# EAGLE design ESP32 and power (EAGLE 9.4.0)
COMPANY: ADAFRUIT INDUSTRIES; DRAWN: KTOWN; REV: B
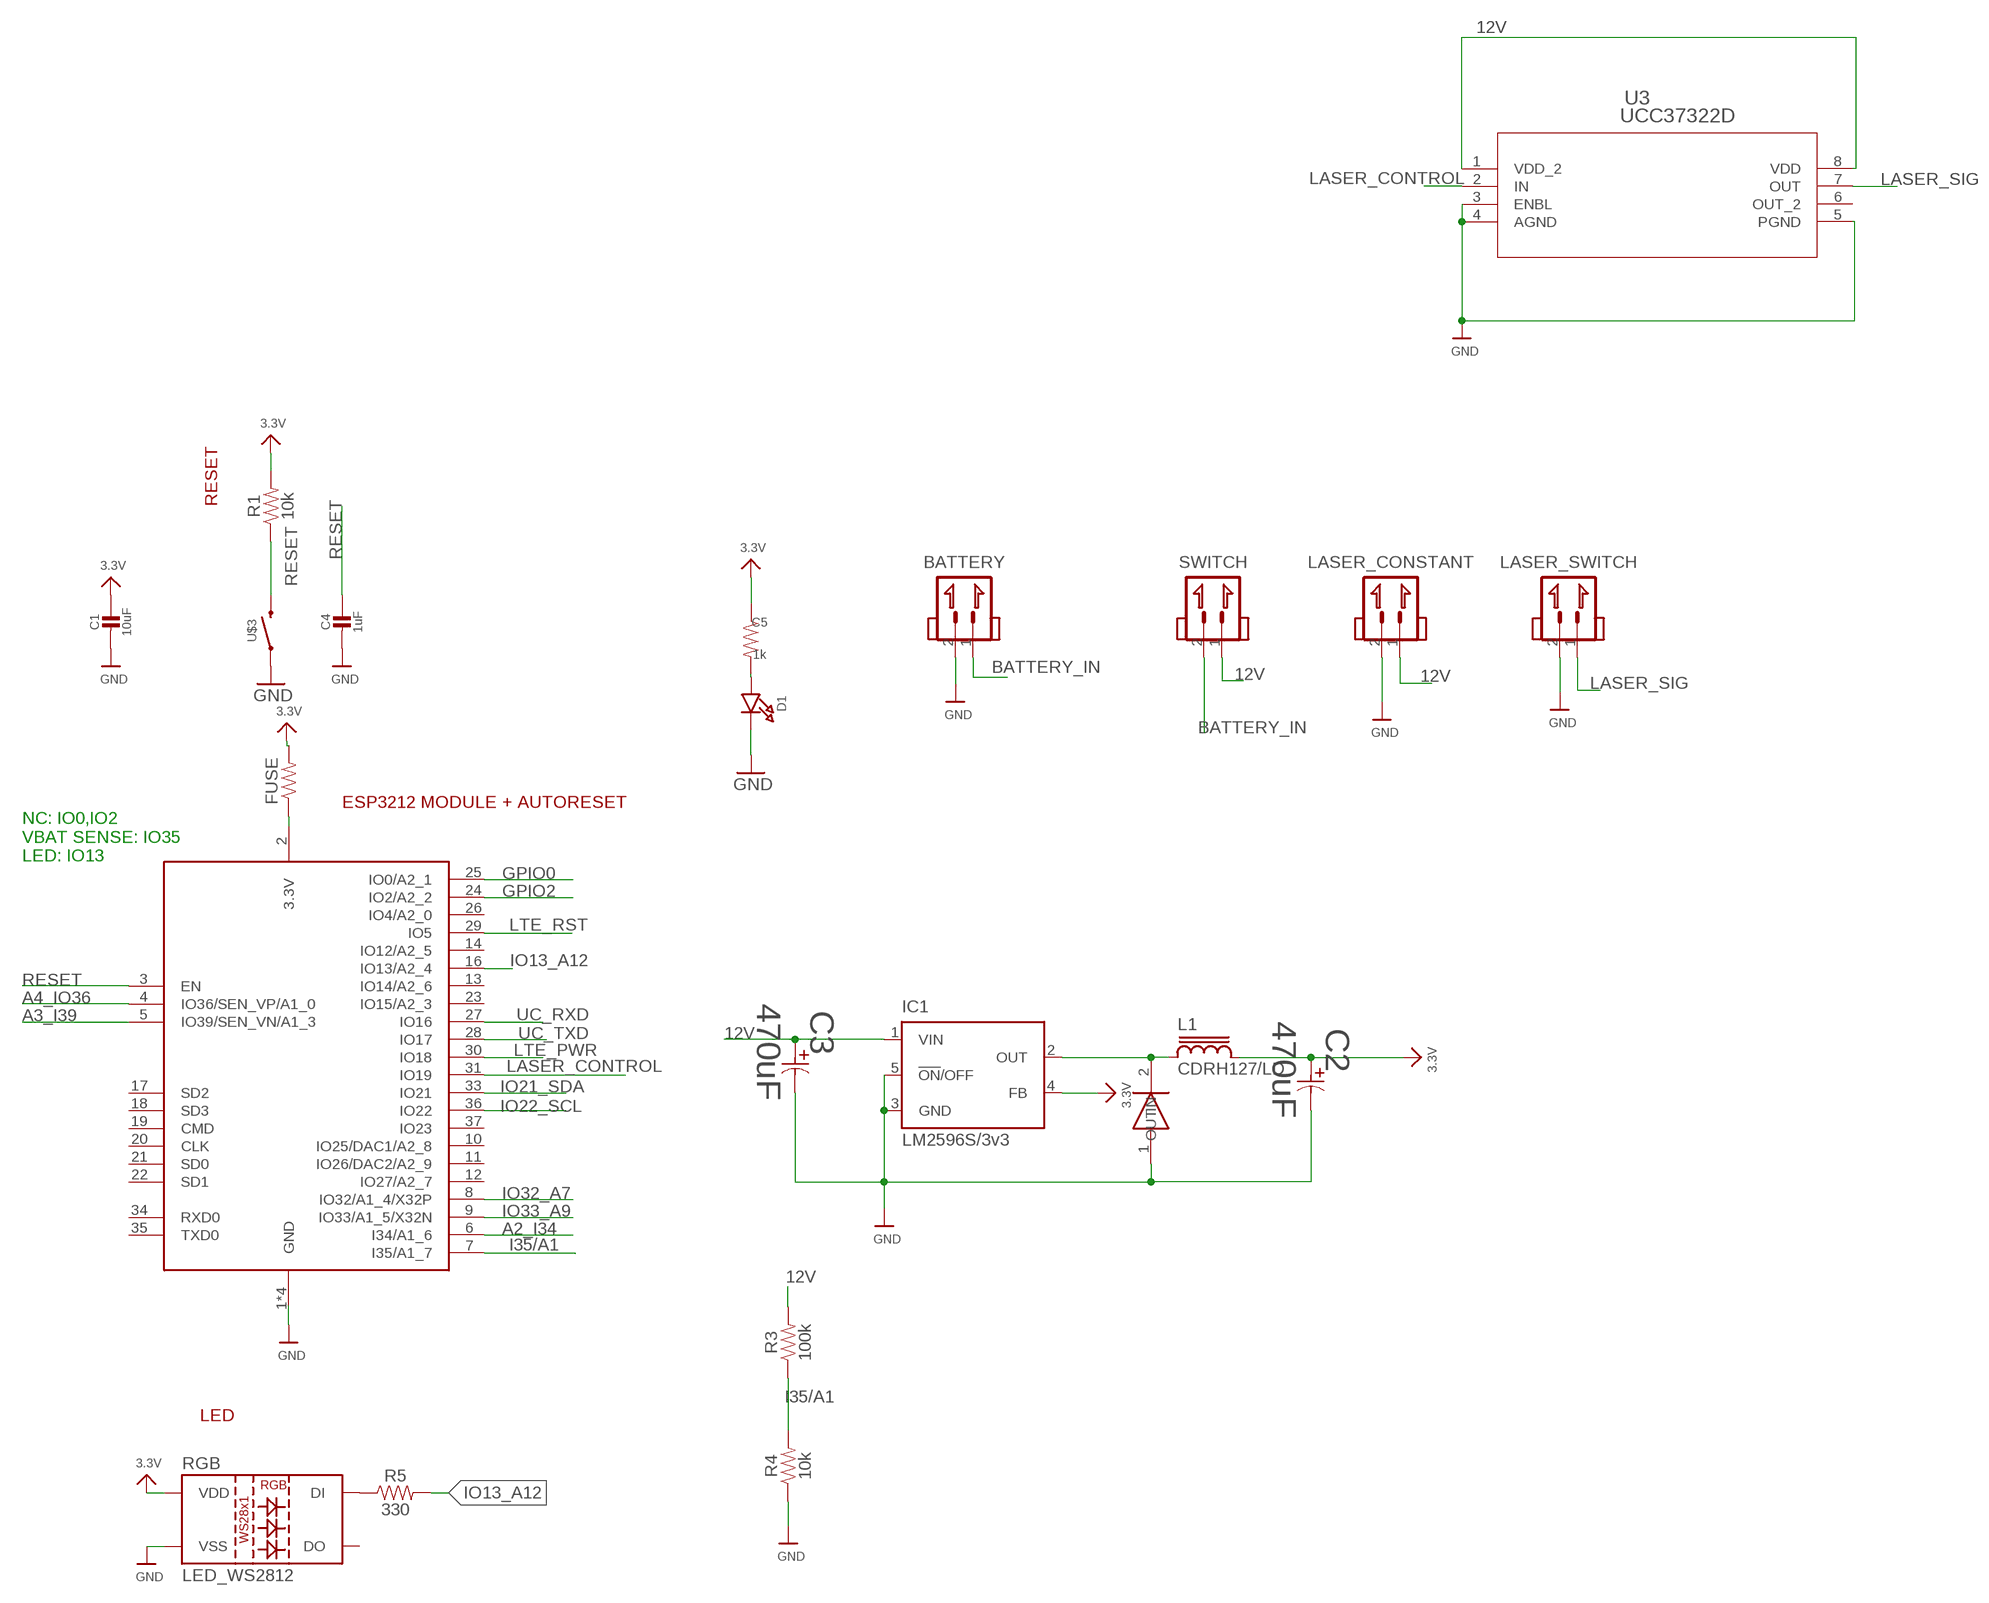
[diagram p0: schematic, sheet 1, part 1 of 2]
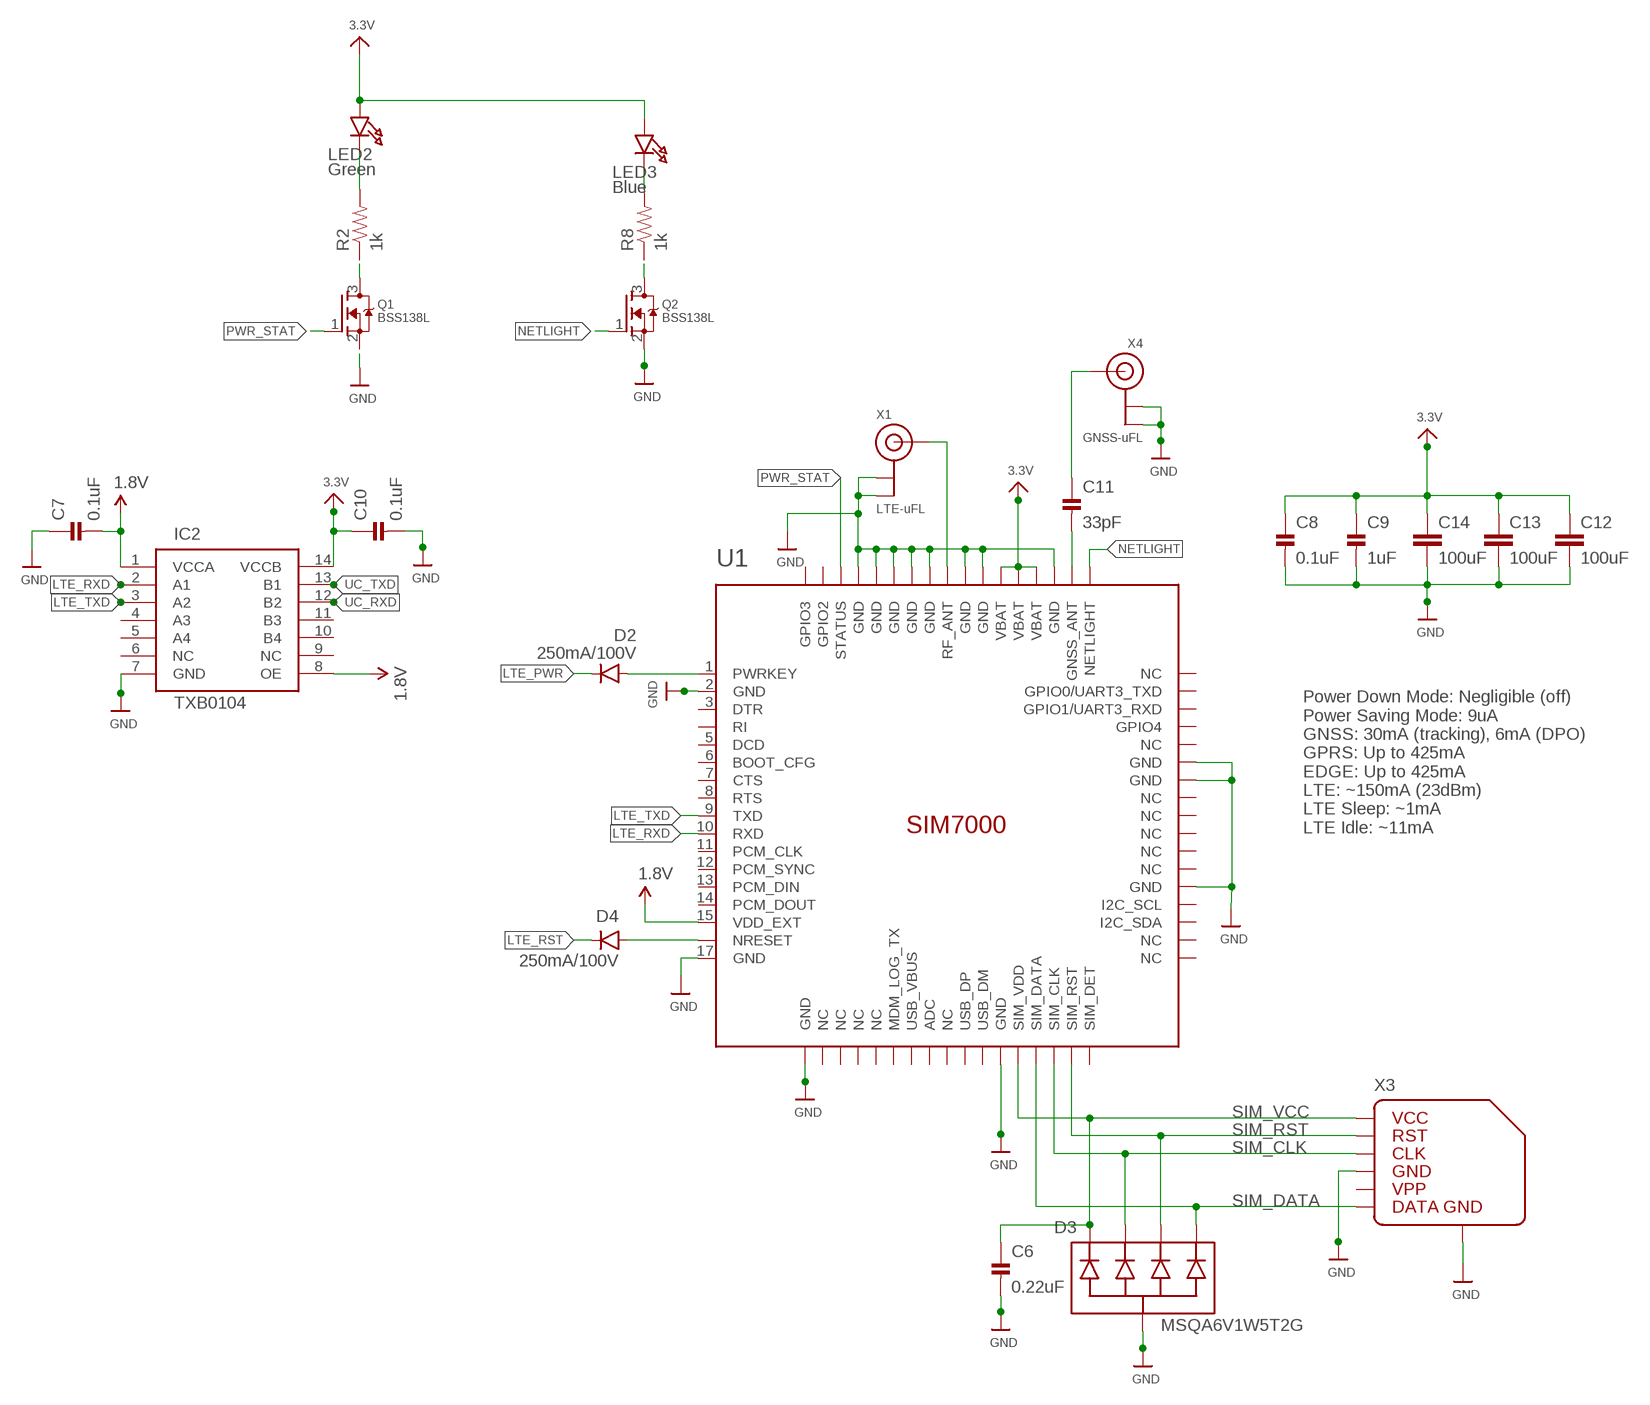
[diagram p1: schematic, sheet 1, part 2 of 2]

## Parts
BATTERY  JST_XH_2.54_2P  [JST_XH_2.54_2P]
C1  10uF  CAP_CERAMIC_0603  [CAP_0603]
C2  470uF  UCD1C471MNL1GS  [PCAP_8X10-ELECT]
C3  470uF  UCD1C471MNL1GS  [PCAP_8X10-ELECT]
C4  1uF  CAP_CERAMIC_0603  [CAP_0603]
C5  1k  RESISTOR0603  [0603]
C6  0.22uF  CAP_CERAMIC_0603  [CAP_0603]
C7  0.1uF  CAP_CERAMIC_0603  [CAP_0603]
C8  0.1uF  CAP_CERAMIC_0603  [CAP_0603]
C9  1uF  CAP_CERAMIC_0603  [CAP_0603]
C10  0.1uF  CAP_CERAMIC_0603  [CAP_0603]
C11  33pF  CAP_CERAMIC_0603  [CAP_0603]
C12  100uF  CAPMARKED-1210  [1210]
C13  100uF  CAPMARKED-1210  [1210]
C14  100uF  CAPMARKED-1210  [1210]
D1  LED0603  [MICROBUILDER_CHIPLED_0603]
D2  250mA/100V  DIODESOD323  [SOD-323]
D3  MSQA6V1W5T2G  TVS-DIODE-ARRAY-4X  [SOT-353]
D4  250mA/100V  DIODESOD323  [SOD-323]
FUSE  RESISTOR1206  [1206]
IC1  LM2596S/3v3  LM2596S  [TO263-5]
IC2  TXB0104  LEVEL_SHIFTER_TXB0104  [TSSOP-14]
L1  CDRH127/LD  [CDRH127/LD]
LASER_CONSTANT  JST_XH_2.54_2P  [JST_XH_2.54_2P]
LASER_SWITCH  JST_XH_2.54_2P  [JST_XH_2.54_2P]
LED2  Green  LED0603  [MICROBUILDER_CHIPLED_0603]
LED3  Blue  LED0603  [MICROBUILDER_CHIPLED_0603]
Q1  BSS138L  MOSFET-NGENERIC  [SOT23-3]
Q2  BSS138L  MOSFET-NGENERIC  [SOT23-3]
R1  10k  RESISTOR0603  [0603]
R2  1k  RESISTOR0603  [0603]
R3  100k  RESISTOR0603  [0603]
R4  10k  RESISTOR0603  [0603]
R5  330  RESISTOR0603  [0603]
R8  1k  RESISTOR0603  [0603]
RGB  LED_WS2812  [LED-TRICOLOR-5050-IC]
SS34  40V3A  SMA-SS34  [SMA-SS34]
SWITCH  JST_XH_2.54_2P  [JST_XH_2.54_2P]
U1  SIM7000  [SIM7000]
U3  UCC37322D  [D8]
U$3  PUSHBUTTON  [TACTILE_SWITCH_SMD_6.0X3.5MM]
X1  LTE-uFL  ANTENNA_U.FL  [U.FL]
X2  ESP32_WROOM32_SKINNY  [WROOM32_SKINNY]
X3  MICROSIM_SOCKET  [MICROSIM_SOCKET]
X4  GNSS-uFL  ANTENNA_U.FL  [U.FL]

## Nets
1.8V: C7.2 IC2.1(VCCA) IC2.8(OE) U1.15(VDD_EXT)
3.3V: C1.1 C2.1 C5.1 C8.1 C9.1 C10.1 C12.1 C13.1 C14.1 FUSE.2 IC1.4(FB) IC2.14(VCCB) L1.2 LED2.A LED3.A R1.2 RGB.VDD U1.55(VBAT) U1.56(VBAT) U1.57(VBAT)
12V: C3.1 IC1.1(VIN) LASER_CONSTANT.1 R3.2 SWITCH.1 U3.1(VDD_2) U3.8(VDD)
A2_I34: X2.6(I34/A1_6)
A3_I39: X2.5(IO39/SEN_VN/A1_3)
A4_IO36: X2.4(IO36/SEN_VP/A1_0)
BATTERY_IN: BATTERY.1 SWITCH.2
GND: BATTERY.2 C1.2 C2.2 C3.2 C4.2 C6.2 C7.1 C8.2 C9.2 C10.2 C12.2 C13.2 C14.2 D1.C D3.2(COM) IC1.3(GND) IC1.5(!ON!/OFF) IC2.7(GND) LASER_CONSTANT.2 LASER_SWITCH.2 Q1.2(S) Q2.2(S) R4.1 RGB.VSS SS34.1(IN) U1.2(GND) U1.17(GND) U1.18(GND) U1.29(GND) U1.39(GND) U1.45(GND) U1.46(GND) U1.54(GND) U1.58(GND) U1.59(GND) U1.61(GND) U1.62(GND) U1.63(GND) U1.64(GND) U1.65(GND) U3.3(ENBL) U3.4(AGND) U3.5(PGND) U$3.1 X1.1(GND) X1.2(GND) X2.1(GND) X2.15(GND) X2.38(GND) X2.P$1(GND) X3.C5 X3.GND@1(GND) X3.GND@2(GND) X3.GND@3(GND) X3.GND@4(GND) X4.1(GND) X4.2(GND)
GPIO0: X2.25(IO0/A2_1)
GPIO2: X2.24(IO2/A2_2)
I35/A1: R3.1 R4.2 X2.7(I35/A1_7)
IO13_A12: R5.2 X2.16(IO13/A2_4)
IO21_SDA: X2.33(IO21)
IO22_SCL: X2.36(IO22)
IO32_A7: X2.8(IO32/A1_4/X32P)
IO33_A9: X2.9(IO33/A1_5/X32N)
LASER_CONTROL: U3.2(IN) X2.31(IO19)
LASER_SIG: LASER_SWITCH.1 U3.7(OUT)
LTE_PWR: D2.C X2.30(IO18)
LTE_RST: D4.C X2.29(IO5)
LTE_RXD: IC2.2(A1) U1.10(RXD)
LTE_TXD: IC2.3(A2) U1.9(TXD)
N$1: IC1.2(OUT) L1.1 SS34.2(OUT)
N$2: R5.1 RGB.DIN(DI)
N$3: C5.2 D1.A
N$4: D2.A U1.1(PWRKEY)
N$5: C11.2 U1.53(GNSS_ANT)
N$6: C11.1 X4.3(SIGNAL)
N$7: Q1.3(D) R2.1
N$8: LED2.C R2.2
N$9: LED3.C R8.2
N$10: Q2.3(D) R8.1
N$11: FUSE.1 X2.2(3.3V)
NETLIGHT: Q2.1(G) U1.52(NETLIGHT)
NRESET: D4.A U1.16(NRESET)
PWR_STAT: Q1.1(G) U1.66(STATUS)
RESET: C4.1 R1.1 U$3.2 X2.3(EN)
RF_ANT: U1.60(RF_ANT) X1.3(SIGNAL)
SIM_CLK: D3.3 U1.32(SIM_CLK) X3.C3
SIM_DATA: D3.5 U1.31(SIM_DATA) X3.C7
SIM_RST: D3.4 U1.33(SIM_RST) X3.C2
SIM_VCC: C6.1 D3.1 U1.30(SIM_VDD) X3.C1
UC_RXD: IC2.12(B2) X2.27(IO16)
UC_TXD: IC2.13(B1) X2.28(IO17)
Unconnected: IC2.4(A3) IC2.5(A4) IC2.6(NC) IC2.9(NC) IC2.10(B4) IC2.11(B3) RGB.DOUT(DO) U1.3(DTR) U1.4(RI) U1.5(DCD) U1.6(BOOT_CFG) U1.7(CTS) U1.8(RTS) U1.11(PCM_CLK) U1.12(PCM_SYNC) U1.13(PCM_DIN) U1.14(PCM_DOUT) U1.19(NC) U1.20(NC) U1.21(NC) U1.22(NC) U1.23(MDM_LOG_TX) U1.24(USB_VBUS) U1.25(ADC) U1.26(NC) U1.27(USB_DP) U1.28(USB_DM) U1.34(SIM_DET) U1.35(NC) U1.36(NC) U1.37(I2C_SDA) U1.38(I2C_SCL) U1.40(NC) U1.41(NC) U1.42(NC) U1.43(NC) U1.44(NC) U1.47(NC) U1.48(GPIO4) U1.49(GPIO1/UART3_RXD) U1.50(GPIO0/UART3_TXD) U1.51(NC) U1.67(GPIO2) U1.68(GPIO3) U3.6(OUT_2) X2.10(IO25/DAC1/A2_8) X2.11(IO26/DAC2/A2_9) X2.12(IO27/A2_7) X2.13(IO14/A2_6) X2.14(IO12/A2_5) X2.17(SD2) X2.18(SD3) X2.19(CMD) X2.20(CLK) X2.21(SD0) X2.22(SD1) X2.23(IO15/A2_3) X2.26(IO4/A2_0) X2.34(RXD0) X2.35(TXD0) X2.37(IO23) X3.C6

## Notes on the sheet
- RESET
- ESP3212 MODULE + AUTORESET
- NC: IO0,IO2
  VBAT SENSE: IO35
  LED: IO13
- Power Down Mode: Negligible (off)
  Power Saving Mode: 9uA
  GNSS: 30mA (tracking), 6mA (DPO)
  GPRS: Up to 425mA
  EDGE: Up to 425mA
  LTE: ~150mA (23dBm)
  LTE Sleep: ~1mA
  LTE Idle: ~11mA
- LED

## Library data of the parts
BATTERY LASER_CONSTANT LASER_SWITCH SWITCH = Scott-Connectors:JST_XH_2.54_2P
C1 C4 C6-C11 = Scott-Electrical:CAP_CERAMIC
C2 C3 = 8x10 cap_smd:UCD1C471MNL1GS; MANUFACTURER_PART_NUMBER: UCD1C471MNL1GS; VENDOR: Nichicon
C5 FUSE R1-R5 R8 = Scott-Electrical:RESISTOR: Generic Resistor Package
C12-C14 = TimWoo-Capacitors:CAP: Capacitor Standard 0603 ceramic capacitor, and 0.1" leaded capacitor.
D1 LED2 LED3 = Scott-Electrical:LED: LED 0603 - 0603 Surface Mount Package 2mA: Green LED - Low Power (3.9mcd, 2ma, 1.7Vf) - Digikey: 475-2709-2-ND Orange LED - Low Power (9.8mcd, 2ma, 1.8Vf) - Digikey: 475-1194-2-ND Red LED - Low Power (5mcd, 2ma, 1.8Vf) - Digikey: 475-1195-2-ND Yellow LED - Low Power (7mcd, 2ma, 1.8Vf) - Digikey: 475-1196-2-ND 5mA: Blue LED - Low Power (17mcd, 5ma, 2.9Vf) - Digikey: LNJ937W8CRACT-ND 0805 - 0805 Surface Mount Package 2mA: Red LED (8.8mcd, 2mA, 1.8Vf, Clear) - Low Power [Digikey: 475-2510-1-ND] Green LED (5mcd, 2mA, 1.8Vf, Clear) - Low Power [Digikey: 475-2730-1-ND] Yellow LED (11.3mcd, 2mA, 1.8Vf, Clear) - Low Power [Digikey: 475-2555-1-ND] 20mA: Red LED (104mcd, 20mA, Diffused) - LS R976 [Digikey: 475-1278-6-ND] Red LED (12mcd, 20mA, 2.0Vf, Clear) - APT2012EC [Digikey: 754-1128-1-ND] Green LED (15mcd, 20mA, 2.2Vf, Clear) - APT2012GC [Digikey: 754-1131-1-ND] Orange LED (160mcd, 20mA, 2.1Vf, Clear) - APT2012SECK [Digikey: 754-1130-1-ND] 1206 - 1206 Surface Mount Package Green LED (26mcd, 20mA, Diffused) - LG N971 [Digikey: 475-1407-6-ND] Red LED (15mcd, 20mA, Diffused) - LH N974 [Digikey: 475-1416-6-ND] Cree - Cree High-Power Surface Mount LEDs XPEBWT-L1-0000-00D50 - White 111lm 350mA 2.9Vf 6200K 110° XTEAWT-00-0000-00000LEE3 - White 114lm 350mA 2.85Vf 5000K 115° Everlight - Everlight 45-21 Series Surface Mount LEDs 45-21/QK2C-B2832AC2CB2/2T - Warm White 2000mcd 20mA 3.25Vf 3050K 120° 45-21/LK2C-B38452C4CB2/2T - Nuetral White 2000mcd 20mA 3.25Vf 4150K 120° 45-21/LK2C-B50634C6CB2/2T - Cold White 2200mcd 20mA 3.25Vf 5650K 120° PLCC2 Reverse Mount LS T77K-J1L2-1-0-2-R18-Z - Red 11.25mcd 2mA 1.8Vf 630nm 120° LO T77K-L1M2-24-Z - Orange 19.6mcd 2mA 1.8Vf 606nm 120° LY T77K-K2M1-26-Z - Yellow 15.7mcd 2mA 1.8Vf 587nm 120°
D2 D4 = TimWoo-Diodes:DIODE: Diode These are standard reverse protection diodes and small signal diodes. SMA package can handle up to about 1A. SOD-323 can handle about 200mA. What the SOD-323 package when ordering, there are some mfgs out there that are 5-pin packages.; PROD_ID: DIO-09646
D3 = TimWoo-Diodes:TVS-DIODE-ARRAY-4X
IC1 = national-semiconductor:LM2596: SIMPLE SWITCHER® Power Converter 150 kHz 3A Step-Down Voltage Regulator Source: http://www.national.com/ds/LM/LM2596.pdf; MF: NATIONAL SEMICONDUCTOR; MPN: LM2596S-ADJ/NOPB; OC_FARNELL: 9494367; OC_NEWARK: 41K3842
IC2 = Scott-ICs:LEVEL_SHIFTER_TXB0104
L1 = inductor-sumida:CDRH127/LD: Power Inductor
Q1 Q2 = TimWoo-MOSFETs:MOSFET-N: N-Channel Mosfet DMG2302UK - 20V 2.8A SOT23 [Digikey: DMG2302UK-7DICT-ND] 2N7002E - 60V 260mA SOT23 [Digikey: 2N7002ET1GOSTR-ND] - REEL BSH103 - 30V 850mA SOT23 [Digikey: 568-5013-1-ND]
RGB = Scott-ICs:LED_WS2812
SS34 = SMA-SS34:SMA-SS34
U1 = TimWoo-RF:SIM7000
U3 = UCC37322d:UCC37322D; MANUFACTURER_PART_NUMBER: UCC37322D; VENDOR: Texas Instruments
U$3 = Scott-Switches:PUSHBUTTON
X1 X4 = TimWoo-Connectors:ANTENNA_U.FL: U.FL Antenna Connector
X2 = microbuilder:ESP32_WROOM32
X3 = Scott-Connectors:MICROSIM_SOCKET: https://detail.tmall.com/item.htm?spm=a230r.1.14.13.35ab360dMATvut&id=525433574500&cm_id=140105335569ed55e27b&abbucket=1

## Board
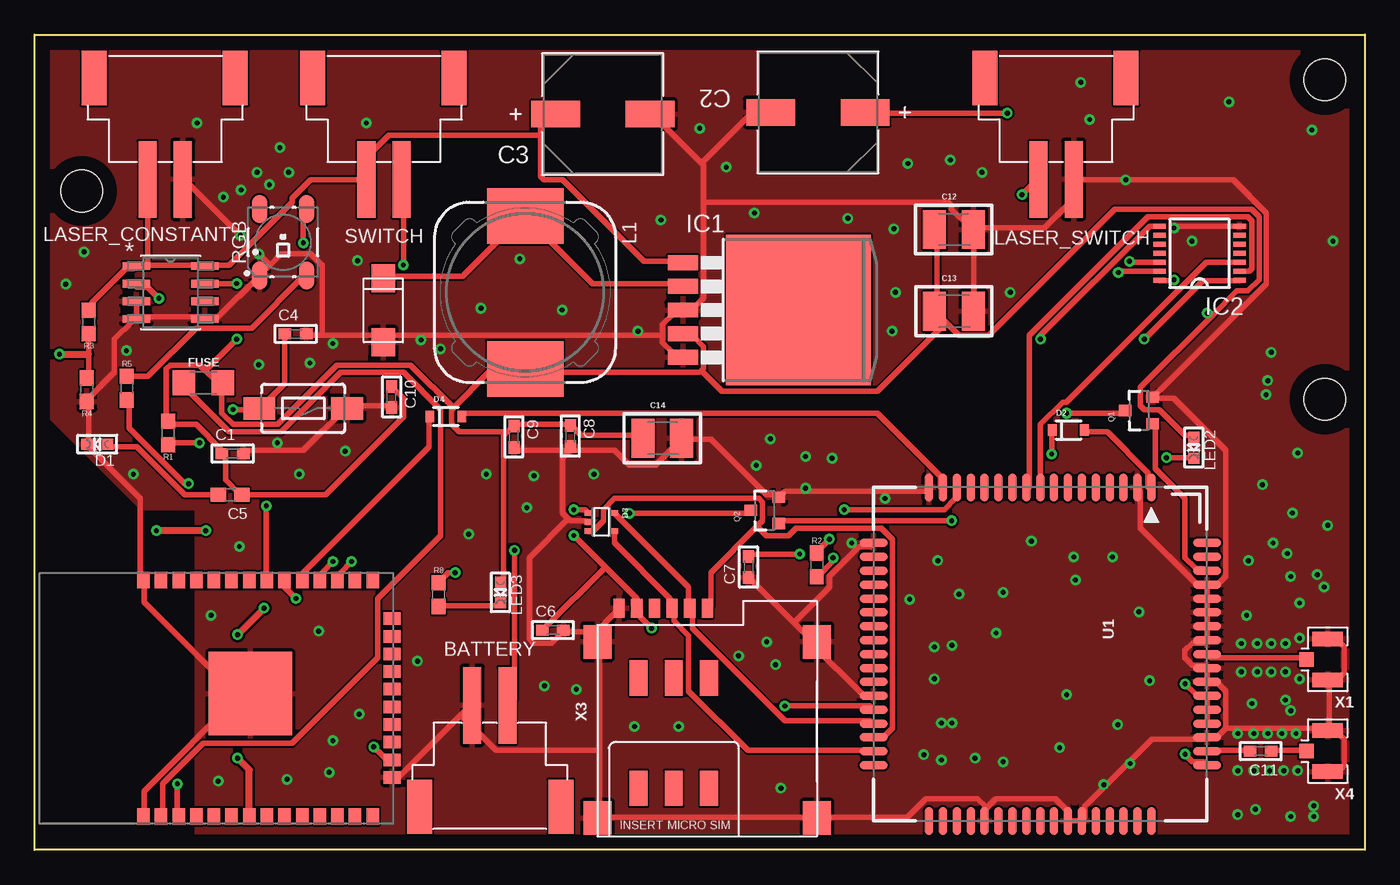
[diagram p2: board, top side]
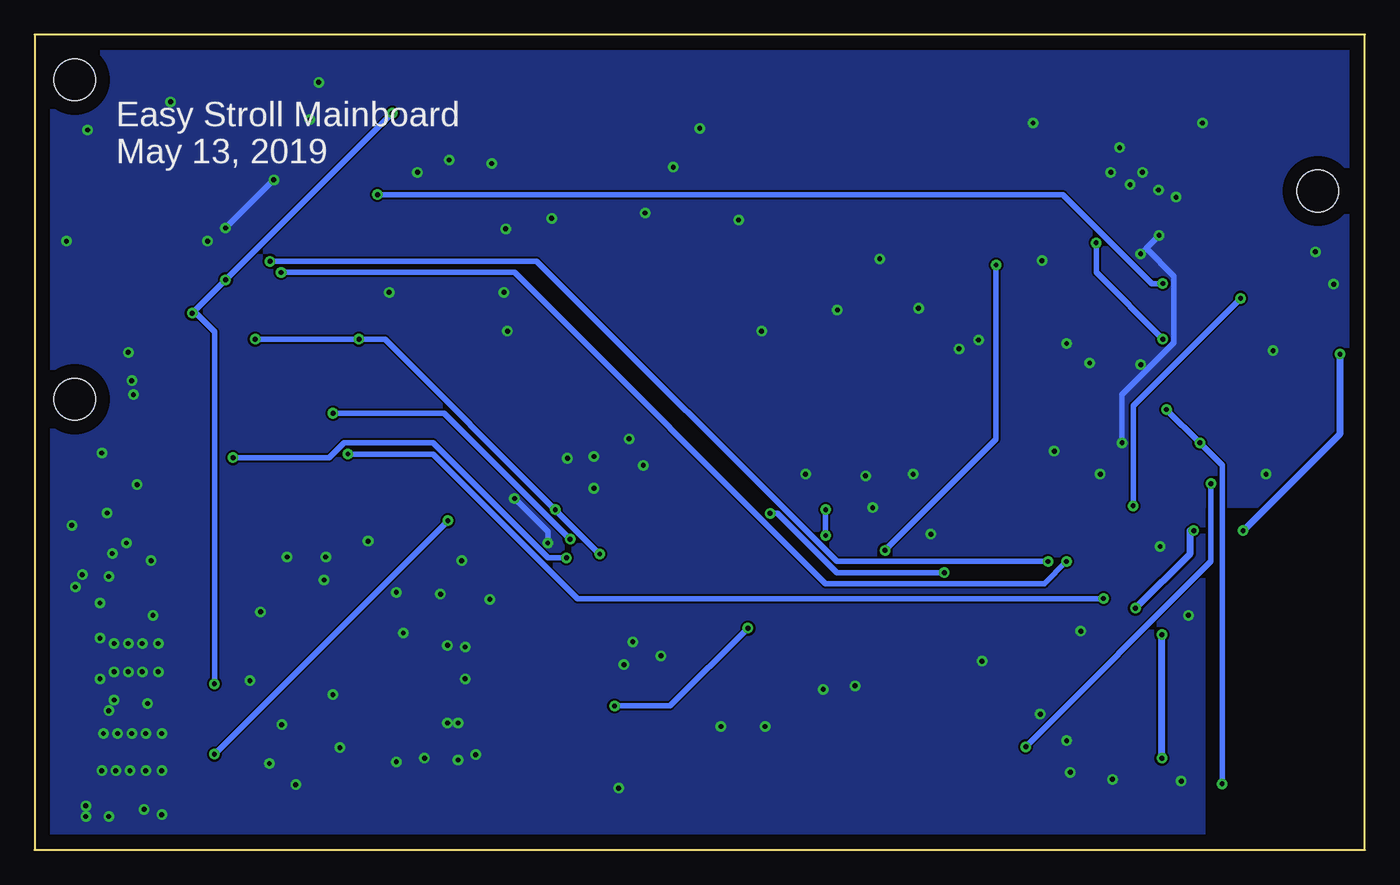
[diagram p3: board, bottom side, seen from below]

Size 95.76 x 58.67 mm. Coordinates in mm from the lower left corner, seen from the top.
Outline: 95.76,0 0,0 0,58.67 95.76,58.67 95.76,0
Copper layers (1*16): Top 0.035mm / dielectric 1.5mm / Bottom 0.035mm
Design rules "default *": minimum track width 15mil, minimum drill 0.35mm, track to track 6mil, track to pad 6mil, pad to pad 6mil, via to via 6mil, smd to smd 6mil, copper to edge 40mil, drill to drill 6mil, minimum pad ring 10mil, minimum via ring 8mil, stop-mask expansion 4mil, vias tented up to drill 20mil, thermal gap 10mil
Holes 3 mm at 92.87,55.43 3.37,47.43 92.87,32.43

### Footprints (pad centres in the part's own frame; a part is rotated, then mirrored left to right if it is on the bottom)
JST_XH_2.54_2P = smd 1.3 x 5.5: 1 -1.27,-5.334; 2 1.27,-5.334 | smd 1.8 x 3.9: NC@1 -5.12,1.966; NC@2 5.04,1.966
CAP_0603 = smd 0.9 x 0.8: 1 -0.762,0; 2 0.762,0
PCAP_8X10-ELECT = smd 3.505 x 1.905: 1 -3.404,0; 2 3.404,0
0603 = smd 1.1 x 1: 1 -0.85,0; 2 0.85,0
1210 = smd 1.651 x 2.794: 1 -1.397,0; 2 1.397,0
MICROBUILDER_CHIPLED_0603 = smd 0.8 x 0.8: A 0,-0.75; C 0,0.75
SOD-323 = smd 0.63 x 0.83: A 1.15,0; C -1.15,0
SOT-353 = smd 0.4 x 0.5: 1 -0.65,-0.95; 2 0,-0.95; 3 0.65,-0.95; 4 0.65,0.95; 5 -0.65,0.95
1206 = smd 1.6 x 1.8: 1 -1.4,0; 2 1.4,0
TO263-5 = smd 1.067 x 2.159: 1 -3.404,-5.791; 2 -1.702,-5.791; 3 0,-5.791; 4 1.702,-5.791; 5 3.404,-5.791 | smd 10.8 x 10.41: 6 0,2.54
TSSOP-14 = smd 0.9 x 0.35: 1 -2.875,1.95; 2 -2.875,1.3; 3 -2.875,0.65; 4 -2.875,0; 5 -2.875,-0.65; 6 -2.875,-1.3; 7 -2.875,-1.95; 8 2.875,-1.95; 9 2.875,-1.3; 10 2.875,-0.65; 11 2.875,0; 12 2.875,0.65; 13 2.875,1.3; 14 2.875,1.95
CDRH127/LD = smd 4 x 5.5: 1 -5.5,0; 2 5.5,0
SOT23-3 = smd 0.8 x 0.9: 1 -0.95,-1; 2 0.95,-1; 3 0,1
LED-TRICOLOR-5050-IC = smd 2 x 1.1: DIN -2.4,-1.7; DOUT 2.4,1.7; VDD 2.4,-1.7; VSS -2.4,1.7
SMA-SS34 = smd 2 x 1.7: 1 0,-1.4; 2 4.6,-1.4
SIM7000 = smd 2 x 0.6: 1 -12,8; 2 -12,7; 3 -12,6; 4 -12,5; 5 -12,4; 6 -12,3; 7 -12,2; 8 -12,1; 9 -12,0; 10 -12,-1; 11 -12,-2; 12 -12,-3; 13 -12,-4; 14 -12,-5; 15 -12,-6; 16 -12,-7; 17 -12,-8; 35 12,-8; 36 12,-7; 37 12,-6; 38 12,-5; 39 12,-4; 40 12,-3; 41 12,-2; 42 12,-1; 43 12,0; 44 12,1; 45 12,2; 46 12,3; 47 12,4; 48 12,5; 49 12,6; 50 12,7; 51 12,8 | smd 0.6 x 2: 18 -8,-12; 19 -7,-12; 20 -6,-12; 21 -5,-12; 22 -4,-12; 23 -3,-12; 24 -2,-12; 25 -1,-12; 26 0,-12; 27 1,-12; 28 2,-12; 29 3,-12; 30 4,-12; 31 5,-12; 32 6,-12; 33 7,-12; 34 8,-12; 52 8,12; 53 7,12; 54 6,12; 55 5,12; 56 4,12; 57 3,12; 58 2,12; 59 1,12; 60 0,12; 61 -1,12; 62 -2,12; 63 -3,12; 64 -4,12; 65 -5,12; 66 -6,12; 67 -7,12; 68 -8,12
D8 = smd 1.981 x 0.559: 1 -2.464,1.905; 2 -2.464,0.635; 3 -2.464,-0.635; 4 -2.464,-1.905; 5 2.464,-1.905; 6 2.464,-0.635; 7 2.464,0.635; 8 2.464,1.905
TACTILE_SWITCH_SMD_6.0X3.5MM = smd 2.3 x 1.6: 1 -3.15,0; 2 3.15,0
U.FL = smd 2.2 x 1.05: 1 0,1.475; 2 0,-1.475 | smd 1.05 x 1.05: 3 1.525,0
WROOM32_SKINNY = smd 1.2 x 0.9: 1 -8.5,5; 2 -8.5,3.73; 3 -8.5,2.46; 4 -8.5,1.19; 5 -8.5,-0.08; 6 -8.5,-1.35; 7 -8.5,-2.62; 8 -8.5,-3.89; 9 -8.5,-5.16; 10 -8.5,-6.43; 11 -8.5,-7.7; 12 -8.5,-8.97; 13 -8.5,-10.24; 14 -8.5,-11.51; 25 8.5,-11.51; 26 8.5,-10.24; 27 8.5,-8.97; 28 8.5,-7.7; 29 8.5,-6.43; 30 8.5,-5.16; 31 8.5,-3.89; 32 8.5,-2.62; 33 8.5,-1.35; 34 8.5,-0.08; 35 8.5,1.19; 36 8.5,2.46; 37 8.5,3.73; 38 8.5,5 | smd 0.9 x 1.2: 15 -5.7,-12.9; 16 -4.43,-12.9; 17 -3.16,-12.9; 18 -1.89,-12.9; 19 -0.62,-12.9; 20 0.65,-12.9; 21 1.92,-12.9; 22 3.19,-12.9; 23 4.46,-12.9; 24 5.73,-12.9 | smd 6 x 6: P$1 0.34,-2.7
MICROSIM_SOCKET = smd 0.8 x 1.35: C1 4.865,13.215; C2 7.405,13.215; C3 9.945,13.215; C5 3.595,13.215; C6 6.135,13.215; C7 8.675,13.215 | smd 2 x 2.4: GND@1 2.035,10.79; GND@2 17.835,10.79; GND@3 2.035,-1.89; GND@4 17.835,-1.89 | smd 1.27 x 2.54: NC@1 4.985,8.18; NC@2 7.525,8.18; NC@3 10.065,8.18; NC@4 4.985,0.26; NC@5 7.525,0.26; NC@6 10.065,0.26

### Placement (x,y rotation side)
BATTERY  32.77,5.08 180 top
C1  14.25,28.53 0 top
C2  56.39,53.09 180 top
C3  40.89,52.96 0 top
C4  18.79,37.14 0 top
C5  14.07,25.56 180 top
C6  37.3,15.82 0 top
C7  51.39,20.37 90 top
C8  38.56,29.79 270 top
C9  34.5,29.74 270 top
C10  25.69,32.61 270 top
C11  88.27,7.11 180 top
C12  66.17,44.65 0 top
C13  66.18,38.78 0 top
C14  45.18,29.63 0 top
D1  4.51,29.21 90 top
D2  74.42,30.23 0 top
D3  40.8,23.61 270 top
D4  29.61,31.21 0 top
FUSE  12.14,33.63 0 top
IC1  52.45,38.86 270 top
IC2  83.86,42.95 180 top
L1  35.31,40.13 270 top
LASER_CONSTANT  9.4,53.59 0 top
LASER_SWITCH  73.53,53.59 0 top
LED2  83.44,28.96 180 top
LED3  33.53,18.53 180 top
Q1  79.5,31.63 90 top
Q2  52.55,24.45 90 top
R1  9.62,30.01 90 top
R2  56.3,20.51 270 top
R3  3.89,38 90 top
R4  3.75,33.13 90 top
R5  6.63,33.24 270 top
R8  29.08,18.38 270 top
RGB  17.88,43.74 90 top
SS34  23.7,36.54 90 top
SWITCH  25.15,53.59 0 top
U1  72.39,14.1 270 top
U3  9.78,40.12 0 top
U$3  19.33,31.78 180 top
X1  93.09,13.72 180 top
X2  12.83,10.92 90 top
X3  38.48,4.19 0 top
X4  93.09,7.11 180 top

### Tracks (layer width: path | path; a pad name or v marks a point on that pad's centre or on a via)
1.8V  (via drill 0.35)
  Top 0.381: v55.08,21.3 51.61,21.3 C7.2 | v58.28,24.5 65.48,24.5 66.28,25.3 66.28,25.83 U1.15 | v72.42,36.77 72.42,37.03 80.28,44.89 IC2.8 | IC2.1 86.72,40.98 84.1,40.98 v79.88,36.77
  Bottom 0.381: v55.08,21.3 v58.28,24.5 70.55,36.77 v72.42,36.77 v79.88,36.77
3.3V  (via drill 0.35)
  Top 0.381: C10.1 25.74,33.3 26.54,32.5 26.54,31.17 20.94,25.57 15.07,25.57 C5.1 14.81,25.57 13.74,26.63 13.74,28.5 C1.1 13.47,28.77 11.61,30.63 9.74,30.63 R1.2 9.47,30.9 9.47,34.63 9.74,34.9 11.88,34.9 12.27,34.5 | 12.27,34.5 12.94,33.83 13.47,33.83 FUSE.2 13.47,33.57 13.47,31.43 14.27,30.63 17.48,30.63 21.74,34.9 27.08,34.9 30.14,31.83 | v19.34,43.7 19.34,46.1 RGB.VDD | 12.27,34.5 v14.54,36.77 | 48.01,34.5 47.88,34.37 35.34,34.37 L1.2 35.08,34.37 32.68,34.37 30.14,31.83 | 48.01,34.5 48.15,34.63 48.15,36.23 47.35,37.03 46.81,37.03 IC1.4 | 33.88,29.97 34.28,30.37 C9.1 34.54,30.63 38.54,30.63 C8.1 38.81,30.37 39.34,29.83 43.61,29.83 C14.1 | 33.88,29.97 33.74,29.83 33.74,19.43 LED3.A | 30.14,31.83 30.01,31.7 30.01,30.63 30.54,30.1 33.74,30.1 33.88,29.97 | U1.55 84.42,9.3 84.42,10.1 U1.56 84.42,10.36 84.42,10.9 U1.57 84.15,11.16 83.62,11.16 v82.82,11.96 | 84.82,38.5 86.55,40.23 87.35,40.23 88.15,41.03 88.15,45.57 87.62,46.1 77.75,46.1 68.68,37.03 66.55,37.03 64.95,38.63 C13.1 | 84.82,38.5 79.62,33.3 79.62,31.97 79.88,31.7 80.95,31.7 82.82,29.83 83.35,29.83 LED2.A | IC2.14 81,40.98 81.97,40.98 v82.02,41.03 | v84.42,38.63 84.68,38.63 84.82,38.5 | C12.1 64.95,44.5 64.95,38.9 C13.1 | v70.02,53.03 59.88,53.03 C2.1 | 48.01,34.5 49.48,33.03 60.68,33.03 65.48,37.83 C13.1
  Bottom 0.381: v19.34,43.7 19.34,41.57 v14.54,36.77 | v82.82,11.96 82.82,37.3 84.15,38.63 v84.42,38.63 v82.02,41.03 v70.02,53.03
12V
  Top 0.381: R3.2 4.14,38.9 4.14,39.43 6.54,41.83 7.07,41.83 U3.1 | 8.14,42.1 7.34,42.1 U3.1 | 8.14,42.1 12.14,42.1 U3.8 12.41,42.1 14.01,42.1 18.54,46.63 18.54,46.9 19.88,48.23 23.88,48.23 SWITCH.1 23.88,49.83 25.48,51.43 36.41,51.43 | 8.14,42.1 8.14,48.23 LASER_CONSTANT.1 | 8.14,42.1 U3.1 | 36.41,51.43 36.41,52.23 36.94,52.77 37.48,52.77 C3.1 | 36.41,51.43 36.41,48.5 36.68,48.23 38.01,48.23 43.88,42.37 46.54,42.37 IC1.1
BATTERY_IN  (via drill 0.35)
  Top 0.381: v26.54,42.1 26.54,48.23 SWITCH.2 | v34.54,21.57 34.54,10.9 34.28,10.63 BATTERY.1
  Bottom 0.381: v26.54,42.1 26.54,29.57 v34.54,21.57
GND  (via drill 0.35)
  Top 0.381: 30.68,9.7 31.34,10.36 BATTERY.2 | 30.68,9.7 26.28,5.3 25.74,5.3 X2.15 | 40.14,15.43 40.41,15.16 X3.GND@1 | 40.14,15.43 39.88,15.7 38.28,15.7 C6.2 38.01,15.7 37.21,14.9 35.88,14.9 35.61,15.16 35.61,21.03 38.41,23.83 | 40.14,15.43 42.01,17.3 X3.C5 | 40.14,15.43 X3.GND@1 | 40.68,7.16 40.68,14.9 X3.GND@1 | 40.68,7.16 40.68,2.36 | 30.68,9.7 33.21,7.16 40.68,7.16 | 54.68,16.36 56.15,14.9 X3.GND@2 55.88,14.9 59.61,11.16 60.15,11.16 U1.29 | 54.68,16.36 51.61,19.43 C7.1 | 59.21,21.7 57.21,19.7 57.21,18.9 54.68,16.36 | 59.21,21.7 59.35,21.83 60.15,21.83 U1.18 | 38.41,23.83 38.01,24.23 38.01,28.23 38.54,28.77 C8.2 | 38.41,23.83 38.54,23.7 39.61,23.7 D3.2 | C9.2 34.54,28.77 38.28,28.77 C8.2 | 61.21,25.83 54.01,25.83 53.75,25.57 Q2.2 53.48,25.57 52.68,25.57 48.68,29.57 46.81,29.57 C14.2 46.54,29.57 44.68,27.7 42.81,27.7 41.74,28.77 38.81,28.77 C8.2 | 61.21,25.83 64.15,25.83 U1.17 | v58.81,22.1 59.21,21.7 | 61.21,25.83 v61.21,25.3 | 68.55,3.03 69.22,3.7 73.48,3.7 74.28,2.9 74.28,2.36 U1.45 74.55,2.1 75.35,2.1 U1.46 75.62,2.36 75.62,3.16 80.42,7.96 84.15,7.96 U1.54 84.42,8.23 85.22,8.23 85.75,8.76 | 68.55,3.03 68.42,2.9 68.42,2.36 U1.39 | 68.55,3.03 67.88,3.7 64.15,3.7 62.81,2.36 56.41,2.36 X3.GND@4 56.15,2.36 40.68,2.36 | X4.1 93.22,5.83 94.02,5.83 94.29,6.1 94.29,7.96 93.75,8.5 93.22,8.5 X4.2 | X4.2 93.22,8.76 93.22,12.23 X1.1 93.22,12.5 94.02,12.5 94.29,12.76 94.29,14.63 93.75,15.16 93.22,15.16 X1.2 | 85.75,8.76 85.75,11.43 85.22,11.96 84.42,11.96 U1.58 84.42,12.23 84.42,13.03 U1.59 84.15,13.3 83.35,13.3 82.82,13.83 82.82,14.36 83.35,14.9 84.15,14.9 U1.61 84.42,15.16 84.42,15.96 U1.62 84.42,16.23 84.42,17.03 U1.63 84.42,17.3 84.42,17.83 U1.64 84.42,18.1 84.42,18.9 U1.65
  Top 0.381: U1.65 84.42,19.16 85.22,19.16 85.75,19.7 85.75,28.77 82.02,32.5 80.68,32.5 Q1.2 80.68,32.77 88.68,40.77 88.68,45.83 86.28,48.23 v78.55,48.23 74.82,48.23 LASER_SWITCH.2 74.55,48.23 74.55,46.63 72.68,44.77 67.62,44.77 C12.2 | U1.2 79.62,25.83 79.62,23.16 83.62,19.16 84.15,19.16 U1.65 | 85.75,8.76 92.95,8.76 X4.2 | 40.68,2.36 X3.GND@3 | C13.2 67.62,38.9 67.62,44.5 C12.2 | v82.02,44.77 82.14,44.89 86.58,44.89 86.58,44.9 IC2.7 | 45.21,37.03 45.21,37.83 46.01,38.63 46.54,38.63 IC1.3 46.81,38.9 47.35,38.9 48.15,39.7 48.15,46.63 | 45.21,37.03 45.21,36.5 46.01,35.7 46.54,35.7 IC1.5 | 48.15,46.63 48.15,49.3 48.01,49.43 | 48.01,49.43 44.41,53.03 C3.2 | 48.01,49.43 51.61,53.03 52.95,53.03 C2.2 | X2.1 7.87,2.63 7.87,4.23 14.81,11.16 15.34,11.16 X2.P$1 14.54,11.16 7.87,17.83 7.87,19.16 X2.38 7.61,19.43 7.61,25.3 3.87,29.03 D1.C 3.87,29.3 3.87,32.23 R4.1 3.87,32.5 5.74,34.37 5.74,36.77 7.07,38.1 U3.4 7.34,38.37 | 17.48,28.77 19.34,28.77 22.28,31.7 U$3.1 22.54,31.97 25.48,31.97 C10.2 | 17.48,28.77 15.07,28.77 C1.2 | 20.68,37.03 24.68,37.03 24.94,36.77 SS34.1 24.94,37.03 45.21,37.03 | 20.68,37.03 19.61,37.03 C4.2 | 7.34,38.37 7.34,39.43 U3.3 | 7.34,38.37 12.14,38.37 U3.5 12.41,38.37 13.21,38.37 16.14,41.3 RGB.VSS 16.41,41.57 16.94,42.1 | 20.68,37.03 20.68,42.1 19.88,42.9 17.74,42.9 16.94,42.1 | v14.81,44.23 10.81,48.23 LASER_CONSTANT.2 | 16.94,42.1 v16.14,42.9 | v17.48,29.3 17.48,28.77 | 48.15,46.63 65.75,46.63 66.02,46.37 66.02,46.1 67.35,44.77 C12.2
  Bottom 0.381: v58.81,22.1 58.81,22.9 v61.21,25.3 | v78.55,48.23 v82.02,44.77 | v16.14,42.9 15.74,43.3 | 15.74,43.3 v14.81,44.23 | v17.48,29.3 17.48,32.77 13.74,36.5 13.74,41.3 15.74,43.3
  other vias: 89.03,35.81 88.77,33.78 88.65,32.77 90.04,14.86 89.03,14.86 88.01,14.86 86.87,14.86 86.87,12.83 88.01,12.83 89.03,12.83 90.04,12.83 91.06,12.32 91.06,15.24 90.81,8.38 89.79,8.38 88.77,8.38 87.76,8.38 86.61,8.38 86.61,5.72 87.76,5.72 88.9,5.72 89.92,5.72 90.93,5.72 90.93,28.57 88.39,26.29 93.09,23.37 90.42,19.69 90.55,24.26 87.38,20.83 77.6,21.08 66.55,18.41 73.79,7.37 80.26,12.19 74.93,19.43 66.04,14.73 66.04,9.14 74.3,11.18 69.22,15.62 36.7,11.81 27.56,13.59 20.45,15.75 21.21,5.59 23.37,9.78 12.7,16.89 13.21,4.95 18.16,5.08 22.35,28.7 19.05,27.05 21.46,36.45 19.81,35.05 32.13,38.99 37.97,38.86 34.92,42.54 51.82,45.85 58.55,45.47 49.78,49.15 47.88,51.94 45.09,45.34 17.65,50.55 14.86,47.5 23.88,52.32 11.68,52.32 13.59,46.99 6.6,35.94 16.13,34.92 7.11,27.05 14.73,21.84 21.46,7.87 35.94,26.92 35.43,24.64 40.26,27.05 31.24,22.73 32.51,27.05 27.81,36.7 29.21,36.07 83.31,43.81 70.23,40.13 61.98,40.13 61.72,37.34 61.85,44.7 65.91,49.66 57.4,28.19 51.94,27.69 52.96,29.59 55.5,28.32 55.5,26.04 43.18,8.89 38.99,11.56 52.7,14.99 53.34,13.34 50.67,13.97 2.25,40.72 3.56,43.05 16,48.77 18.29,48.77 16.89,47.88 23.24,42.42 86.61,2.54 90.42,2.41 92.08,2.41 87.88,2.92 92.08,3.17 87.63,10.54 90.04,10.8 90.42,10.03 87.25,16.89 91.06,17.78 92.84,18.92 92.33,19.81 90.17,21.34 89.15,22.1 79.5,17.14 74.8,21.08 71.76,22.23 65.02,20.83 62.99,18.03 69.72,18.54 64.77,14.61 65.28,9.14 64.01,6.86 69.72,6.35 64.77,12.32 65.28,6.48 67.69,6.6 78.87,6.22 76.96,4.7 77.98,9.02 53.72,4.44 46.35,8.89 43.43,37.34 75.95,52.58 75.31,55.24 68.2,48.77 62.86,49.4 91.95,51.82 85.98,53.85 93.47,43.81
  pour Bottom: -1.65,61.72 97.66,61.72 97.66,-1.91 11.68,-1.91 11.68,24.89 -1.65,24.89
  pour Top: -1.52,62.23 97.66,62.23 97.66,-1.78 11.68,-1.78 11.68,24.64 7.75,24.64 -1.65,34.04 -1.65,62.1
I35/A1  (via drill 0.35)
  Top 0.381: R3.1 3.87,37.03 3.87,35.69 3.87,34.1 R4.2 3.61,33.83 | 15.34,2.36 X2.7
  Top 0.508: X2.7 15.45,5.76 v14.6,6.6 | v14.6,15.49 v16.51,17.4 | v12.32,22.99 v8.76,22.99 | v1.78,35.69 3.87,35.69
  Bottom 0.508: v14.6,6.6 v14.6,15.49 | v16.51,17.4 12.57,21.34 12.57,22.99 v12.32,22.99 | v8.76,22.99 1.78,29.97 v1.78,35.69
IO13_A12  (via drill 0.35)
  Top 0.381: v11.07,26.37 10.81,26.37 6.81,30.37 6.81,32.23 R5.2 | v24.41,7.43 25.48,6.36 X2.16
  Bottom 0.381: v11.07,26.37 11.07,20.77 v24.41,7.43
LASER_CONTROL  (via drill 0.35)
  Top 0.381: v16.68,24.77 16.68,19.43 X2.31 | v8.94,39.7 8.14,40.5 7.34,40.5 U3.2
  Bottom 0.381: v16.68,24.77 16.68,31.97 v8.94,39.7
LASER_SIG  (via drill 0.35)
  Top 0.381: v14.54,40.77 12.41,40.77 U3.7 | v71.08,47.17 72.15,48.23 LASER_SWITCH.1
  Bottom 0.381: v14.54,40.77 15.34,40.77 21.74,47.17 v71.08,47.17
LTE_PWR  (via drill 0.35)
  Top 0.381: v73.22,28.5 73.22,30.1 D2.C | v18.81,18.1 17.74,19.16 X2.30
  Bottom 0.381: v73.22,28.5 67.08,28.5 56.68,18.1 v18.81,18.1
LTE_RST
  Top 0.381: D4.C 28.41,31.17 28.41,29.03 19.34,19.96 19.34,19.43 X2.29
LTE_RXD
  Top 0.381: IC2.2 87.43,41.64 87.62,41.83 87.62,45.3 87.35,45.57 80.15,45.57 71.62,37.03 71.62,26.1 U1.10
LTE_TXD
  Top 0.381: IC2.3 84.34,42.29 74.28,32.23 74.02,32.23 72.42,30.63 72.42,26.1 U1.9
N$1
  Top 0.381: SS34.2 25.21,41.3 30.81,41.3 35.08,45.57 L1.1 35.34,45.57 40.14,40.77 46.54,40.77 IC1.2
N$2
  Top 0.381: R5.1 6.81,34.1 8.14,34.1 11.61,37.57 15.61,37.57 19.34,41.3 RGB.DIN
N$3
  Top 0.381: D1.A 5.47,29.03 7.34,29.03 10.81,25.57 13.21,25.57 C5.2
N$4
  Top 0.381: D2.A 75.62,30.1 77.22,30.1 80.15,27.16 80.15,26.1 U1.1
N$5
  Top 0.381: C11.2 87.35,7.16 84.42,7.16 U1.53
N$6
  Top 0.381: C11.1 89.22,7.16 91.35,7.16 X4.3
N$7  (via drill 0.35)
  Top 0.381: v74.28,31.43 78.28,31.43 Q1.3 | v57.21,22.37 56.41,21.57 R2.1
  Bottom 0.381: v74.28,31.43 66.28,31.43 v57.21,22.37
N$8  (via drill 0.35)
  Top 0.381: v81.48,28.23 83.35,28.23 LED2.C | v57.48,21.03 57.48,20.77 56.41,19.7 R2.2
  Bottom 0.381: v81.48,28.23 74.55,28.23 73.48,29.3 67.08,29.3 58.81,21.03 v57.48,21.03
N$9
  Top 0.381: LED3.C 33.48,17.56 29.21,17.56 R8.2
N$10  (via drill 0.35)
  Top 0.381: v42.81,24.23 51.35,24.23 Q2.3 | v30.28,19.96 29.74,19.96 29.21,19.43 R8.1
  Bottom 0.381: v42.81,24.23 42.28,24.23 38.01,19.96 v30.28,19.96
N$11
  Top 0.381: X2.2 9.21,2.63 9.21,4.76 12.14,7.7 18.54,7.7 24.68,13.83 24.68,18.1 29.21,22.63 29.21,31.7 26.54,34.37 22.01,34.37 17.74,30.1 14.01,30.1 10.54,33.57 FUSE.1
NETLIGHT  (via drill 0.35)
  Top 0.381: v66.02,23.7 53.75,23.7 Q2.1 | v82.82,6.9 83.35,6.36 84.15,6.36 U1.52
  Bottom 0.381: v82.82,6.9 v66.02,23.7
NRESET
  Top 0.381: D4.A 30.81,31.43 60.68,31.43 65.21,26.9 65.21,26.1 U1.16
PWR_STAT
  Top 0.381: Q1.1 80.68,30.63 80.68,27.43 82.82,25.3 82.82,21.03 83.62,20.23 84.15,20.23 U1.66
RESET  (via drill 0.35)
  Top 0.381: C4.1 18.01,37.03 18.01,33.57 16.41,31.97 U$3.2 16.14,31.7 v14.27,31.7 | v11.88,29.3 9.74,29.3 R1.1 | v10.27,4.76 10.27,2.63 X2.3
  Bottom 0.381: v14.27,31.7 v11.88,29.3 10.27,27.7 v10.27,4.76
RF_ANT
  Top 0.381: X1.3 91.35,13.83 84.68,13.83 84.42,14.1 U1.60
SIM_CLK
  Top 0.381: 52.01,23.3 48.68,19.96 48.68,17.56 X3.C3 | 52.01,23.3 52.41,23.7 52.41,25.03 52.15,25.3 41.74,25.3 40.95,24.5 40.95,23.7 40.14,22.9 39.88,22.9 D3.3 | 52.01,23.3 52.68,22.63 54.28,22.63 54.81,23.16 60.95,23.16 61.75,22.37 61.75,8.76 61.21,8.23 60.41,8.23 U1.32
SIM_DATA
  Top 0.381: D3.5 41.74,24.23 47.08,18.9 47.08,17.56 X3.C7 47.35,17.3 47.35,15.96 54.01,9.3 60.15,9.3 U1.31
SIM_RST
  Top 0.381: D3.4 41.74,22.9 41.74,22.1 45.74,18.1 45.74,17.56 X3.C2 46.01,17.3 46.01,16.5 47.08,15.43 47.08,11.43 51.35,7.16 60.15,7.16 U1.33
SIM_VCC  (via drill 0.35)
  Top 0.381: v38.81,24.5 39.61,24.5 39.88,24.23 D3.1 | 41.08,20.36 43.34,18.1 43.34,17.56 X3.C1 43.61,17.3 43.61,16.76 v44.41,15.96 | 41.08,20.36 v38.81,22.63 | 41.08,20.36 36.68,15.96 C6.1 | v54.01,10.36 60.15,10.36 U1.30
  Bottom 0.381: v38.81,22.63 v38.81,24.5 | v54.01,10.36 50.01,10.36 v44.41,15.96
UC_RXD  (via drill 0.35)
  Top 0.381: v78.82,42.37 78.87,42.32 80.98,42.32 IC2.12 | v22.81,20.77 22.01,19.96 22.01,19.43 X2.27
  Bottom 0.381: v78.82,42.37 59.61,42.37 38.01,20.77 v22.81,20.77
UC_TXD  (via drill 0.35)
  Top 0.381: v78.02,41.57 78.09,41.64 IC2.13 | v21.48,20.77 20.68,19.96 20.68,19.43 X2.28
  Bottom 0.381: v78.02,41.57 61.21,41.57 38.81,19.16 23.08,19.16 v21.48,20.77

### Text on the board
bPlace: Easy Stroll Mainboard / May 13, 2019